# EAGLE schematic Diseño_de_sist-dig (EAGLE 9.6.2)
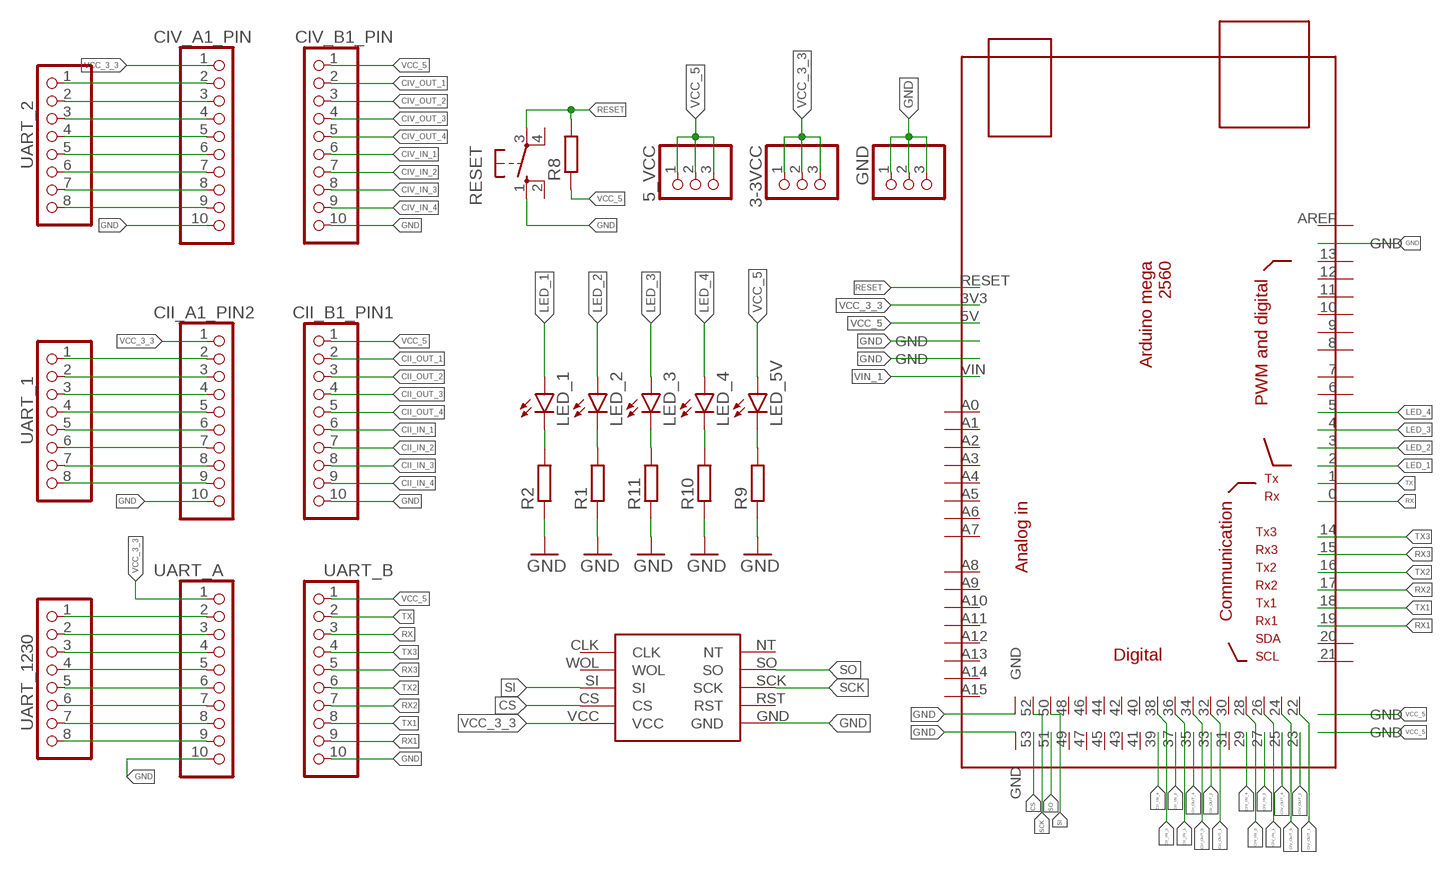
[diagram p0: schematic, sheet 1]

## Parts
3-3VCC  PINHD-1X3  [1X03]
5_VCC  PINHD-1X3  [1X03]
ARDUINOMEGA2560  MEGA_DEVICE  [MEGAOUTLINE]
CII_A1_PIN2  PINHD-1X10  [1X10-BIG]
CII_B1_PIN1  PINHD-1X10  [1X10-BIG]
CIV_A1_PIN  PINHD-1X10  [1X10-BIG]
CIV_B1_PIN  PINHD-1X10  [1X10-BIG]
GND  PINHD-1X3  [1X03]
LED_1  LED3MM  [LED3MM]
LED_2  LED3MM  [LED3MM]
LED_3  LED3MM  [LED3MM]
LED_4  LED3MM  [LED3MM]
LED_5V  LED3MM  [LED3MM]
MODULO_ETHERNET  ENC28J60  [ENC28J60]
R1  R_CHIP-0805(2012-METRIC)  [RESC2012X65]
R2  R_CHIP-0805(2012-METRIC)  [RESC2012X65]
R8  R_CHIP-0805(2012-METRIC)  [RESC2012X65]
R9  R_CHIP-0805(2012-METRIC)  [RESC2012X65]
R10  R_CHIP-0805(2012-METRIC)  [RESC2012X65]
R11  R_CHIP-0805(2012-METRIC)  [RESC2012X65]
RESET  10-XX  [B3F-10XX]
UART_1  PINHD-1X8CLEANBIG  [1X08-CLEANBIG]
UART_2  PINHD-1X8CLEANBIG  [1X08-CLEANBIG]
UART_1230  PINHD-1X8CLEANBIG  [1X08-CLEANBIG]
UART_A  PINHD-1X10  [1X10-BIG]
UART_B  PINHD-1X10  [1X10-BIG]

## Nets
CII_IN_1: ARDUINOMEGA2560.36 CII_B1_PIN1.6
CII_IN_2: ARDUINOMEGA2560.37 CII_B1_PIN1.7
CII_IN_3: ARDUINOMEGA2560.38 CII_B1_PIN1.8
CII_IN_4: ARDUINOMEGA2560.39 CII_B1_PIN1.9
CII_OUT_1: ARDUINOMEGA2560.32 CII_B1_PIN1.2
CII_OUT_2: ARDUINOMEGA2560.33 CII_B1_PIN1.3
CII_OUT_3: ARDUINOMEGA2560.34 CII_B1_PIN1.4
CII_OUT_4: ARDUINOMEGA2560.35 CII_B1_PIN1.5
CIV_IN_1: ARDUINOMEGA2560.26 CIV_B1_PIN.6
CIV_IN_2: ARDUINOMEGA2560.27 CIV_B1_PIN.7
CIV_IN_3: ARDUINOMEGA2560.28 CIV_B1_PIN.8
CIV_IN_4: ARDUINOMEGA2560.29 CIV_B1_PIN.9
CIV_OUT_1: ARDUINOMEGA2560.22 CIV_B1_PIN.2
CIV_OUT_2: ARDUINOMEGA2560.23 CIV_B1_PIN.3
CIV_OUT_3: ARDUINOMEGA2560.24 CIV_B1_PIN.4
CIV_OUT_4: ARDUINOMEGA2560.25 CIV_B1_PIN.5
CS: ARDUINOMEGA2560.53 MODULO_ETHERNET.CS
GND: ARDUINOMEGA2560.GND@1(GND) ARDUINOMEGA2560.GND@2(GND) ARDUINOMEGA2560.GND@3(GND) ARDUINOMEGA2560.GND@6(GND) ARDUINOMEGA2560.GND@7(GND) CII_A1_PIN2.10 CII_B1_PIN1.10 CIV_A1_PIN.10 CIV_B1_PIN.10 GND.1 GND.2 GND.3 MODULO_ETHERNET.GND R1.1 R2.1 R9.1 R10.1 R11.1 RESET.1(S) UART_A.10 UART_B.10
LED_1: ARDUINOMEGA2560.2 LED_1.A
LED_2: ARDUINOMEGA2560.3 LED_2.A
LED_3: ARDUINOMEGA2560.4 LED_3.A
LED_4: ARDUINOMEGA2560.5 LED_4.A
N$5: LED_2.K(C) R1.2
N$6: LED_1.K(C) R2.2
N$7: UART_1230.1 UART_A.2
N$8: LED_5V.K(C) R9.2
N$9: LED_4.K(C) R10.2
N$10: LED_3.K(C) R11.2
N$13: UART_1230.2 UART_A.3
N$15: UART_1230.3 UART_A.4
N$16: UART_1230.4 UART_A.5
N$17: UART_1230.5 UART_A.6
N$18: UART_1230.6 UART_A.7
N$19: UART_1230.7 UART_A.8
N$20: UART_1230.8 UART_A.9
N$36: CII_A1_PIN2.2 UART_1.1
N$37: CIV_A1_PIN.2 UART_2.1
N$38: CIV_A1_PIN.3 UART_2.2
N$39: CIV_A1_PIN.4 UART_2.3
N$40: CIV_A1_PIN.5 UART_2.4
N$41: CIV_A1_PIN.6 UART_2.5
N$42: CIV_A1_PIN.7 UART_2.6
N$43: CIV_A1_PIN.8 UART_2.7
N$44: CIV_A1_PIN.9 UART_2.8
N$46: CII_A1_PIN2.3 UART_1.2
N$47: CII_A1_PIN2.4 UART_1.3
N$48: CII_A1_PIN2.5 UART_1.4
N$49: CII_A1_PIN2.6 UART_1.5
N$50: CII_A1_PIN2.7 UART_1.6
N$51: CII_A1_PIN2.8 UART_1.7
N$52: CII_A1_PIN2.9 UART_1.8
RESET: ARDUINOMEGA2560.RESET R8.2 RESET.3(P)
RX: ARDUINOMEGA2560.0 UART_B.3
RX1: ARDUINOMEGA2560.19 UART_B.9
RX2: ARDUINOMEGA2560.17 UART_B.7
RX3: ARDUINOMEGA2560.15 UART_B.5
SCK: ARDUINOMEGA2560.52 MODULO_ETHERNET.SCK
SI: ARDUINOMEGA2560.50 MODULO_ETHERNET.SI
SO: ARDUINOMEGA2560.51 MODULO_ETHERNET.SO
TX: ARDUINOMEGA2560.1 UART_B.2
TX1: ARDUINOMEGA2560.18 UART_B.8
TX2: ARDUINOMEGA2560.16 UART_B.6
TX3: ARDUINOMEGA2560.14 UART_B.4
VCC_3_3: 3-3VCC.1 3-3VCC.2 3-3VCC.3 ARDUINOMEGA2560.3V3 CII_A1_PIN2.1 CIV_A1_PIN.1 MODULO_ETHERNET.VCC UART_A.1
VCC_5: 5_VCC.1 5_VCC.2 5_VCC.3 ARDUINOMEGA2560.5V ARDUINOMEGA2560.GND@4(GND) ARDUINOMEGA2560.GND@5(GND) CII_B1_PIN1.1 CIV_B1_PIN.1 LED_5V.A R8.1 UART_B.1
VIN_1: ARDUINOMEGA2560.VIN
Unconnected: ARDUINOMEGA2560.6 ARDUINOMEGA2560.7 ARDUINOMEGA2560.8 ARDUINOMEGA2560.9 ARDUINOMEGA2560.10 ARDUINOMEGA2560.11 ARDUINOMEGA2560.12 ARDUINOMEGA2560.13 ARDUINOMEGA2560.20 ARDUINOMEGA2560.21 ARDUINOMEGA2560.30 ARDUINOMEGA2560.31 ARDUINOMEGA2560.40 ARDUINOMEGA2560.41 ARDUINOMEGA2560.42 ARDUINOMEGA2560.43 ARDUINOMEGA2560.44 ARDUINOMEGA2560.45 ARDUINOMEGA2560.46 ARDUINOMEGA2560.47 ARDUINOMEGA2560.48 ARDUINOMEGA2560.49 ARDUINOMEGA2560.A0 ARDUINOMEGA2560.A1 ARDUINOMEGA2560.A2 ARDUINOMEGA2560.A3 ARDUINOMEGA2560.A4 ARDUINOMEGA2560.A5 ARDUINOMEGA2560.A6 ARDUINOMEGA2560.A7 ARDUINOMEGA2560.A8 ARDUINOMEGA2560.A9 ARDUINOMEGA2560.A10 ARDUINOMEGA2560.A11 ARDUINOMEGA2560.A12 ARDUINOMEGA2560.A13 ARDUINOMEGA2560.A14 ARDUINOMEGA2560.A15 ARDUINOMEGA2560.AREF MODULO_ETHERNET.CLK MODULO_ETHERNET.NT MODULO_ETHERNET.RST MODULO_ETHERNET.WOL RESET.2(S1) RESET.4(P1)

## Library data of the parts
3-3VCC 5_VCC GND = Connector:PINHD-1X3: PIN HEADER; CATEGORY: CONNECTOR; SUB-CATEGORY: PIN-HEADER
ARDUINOMEGA2560 = ArduinoMegaOutline:MEGA_DEVICE: mega card as device
CII_A1_PIN2 CII_B1_PIN1 CIV_A1_PIN CIV_B1_PIN UART_A UART_B = adafruit:PINHD-1X10: Pin header 1x10 0.1" spacing With round pins
LED_1-LED_4 LED_5V = led:LED: LED OSRAM: - CHIPLED LG R971, LG N971, LY N971, LG Q971, LY Q971, LO R971, LY R971 LH N974, LH R974 LS Q976, LO Q976, LY Q976 LO Q996 - Hyper CHIPLED LW Q18S LB Q993, LB Q99A, LB R99A - SideLED LS A670, LO A670, LY A670, LG A670, LP A670 LB A673, LV A673, LT A673, LW A673 LH A674 LY A675 LS A676, LA A676, LO A676, LY A676, LW A676 LS A679, LY A679, LG A679 - Hyper Micro SIDELED® LS Y876, LA Y876, LO Y876, LY Y876 LT Y87S - SmartLED LW L88C, LW L88S LB L89C, LB L89S, LG L890 LS L89K, LO L89K, LY L89K LS L896, LA L896, LO L896, LY L896 - TOPLED LS T670, LO T670, LY T670, LG T670, LP T670 LSG T670, LSP T670, LSY T670, LOP T670, LYG T670 LG T671, LOG T671, LSG T671 LB T673, LV T673, LT T673, LW T673 LH T674 LS T676, LA T676, LO T676, LY T676, LB T676, LH T676, LSB T676, LW T676 LB T67C, LV T67C, LT T67C, LS T67K, LO T67K, LY T67K, LW E67C LS E67B, LA E67B, LO E67B, LY E67B, LB E67C, LV E67C, LT E67C LW T67C LS T679, LY T679, LG T679 LS T770, LO T770, LY T770, LG T770, LP T770 LB T773, LV T773, LT T773, LW T773 LH T774 LS E675, LA E675, LY E675, LS T675 LS T776, LA T776, LO T776, LY T776, LB T776 LHGB T686 LT T68C, LB T68C - Hyper Mini TOPLED® LB M676 - Mini TOPLED Santana® LG M470 LS M47K, LO M47K, LY M47K Source: http://www.osram.convergy.de LUXEON: - LUMILED® LXK2-PW12-R00, LXK2-PW12-S00, LXK2-PW14-U00, LXK2-PW14-V00 LXK2-PM12-R00, LXK2-PM12-S00, LXK2-PM14-U00 LXK2-PE12-Q00, LXK2-PE12-R00, LXK2-PE12-S00, LXK2-PE14-T00, LXK2-PE14-U00 LXK2-PB12-K00, LXK2-PB12-L00, LXK2-PB12-M00, LXK2-PB14-N00, LXK2-PB14-P00, LXK2-PB14-Q00 LXK2-PR12-L00, LXK2-PR12-M00, LXK2-PR14-Q00, LXK2-PR14-R00 LXK2-PD12-Q00, LXK2-PD12-R00, LXK2-PD12-S00 LXK2-PH12-R00, LXK2-PH12-S00 LXK2-PL12-P00, LXK2-PL12-Q00, LXK2-PL12-R00 Source: www.luxeon.com KINGBRIGHT: KA-3528ASYC Source: www.kingbright.com
MODULO_ETHERNET = ethernet-mikroavr:ENC28J60: ENC28J60, SHIELD EHTERNET, CREATE BY MIKROAVR.COM
R1 R2 R8-R11 = Resistor:R: Resistor Fixed - Generic; CATEGORY: Resistor; SUB-CATEGORY: Fixed
RESET = switch-omron:10-XX: OMRON SWITCH; MPN: B3F-1000; OC_FARNELL: 176432; OC_NEWARK: 36M3542
UART_1 UART_2 UART_1230 = adafruit:PINHD-1X8: PIN HEADER